# Altium schematic sheet connector-bottom-j1-1.SchDoc: Connector - J1(Bottom) 1
size Letter; CompanyName: Brinton Engineering, LLC; Address1: 3479 Edison Way; Address2: Menlo Park CA 94025; Address3: +1 (877) 778-8435; Address4: brintonengineering.com; Revision: 1; SheetNumber: 1; SheetTotal: 1
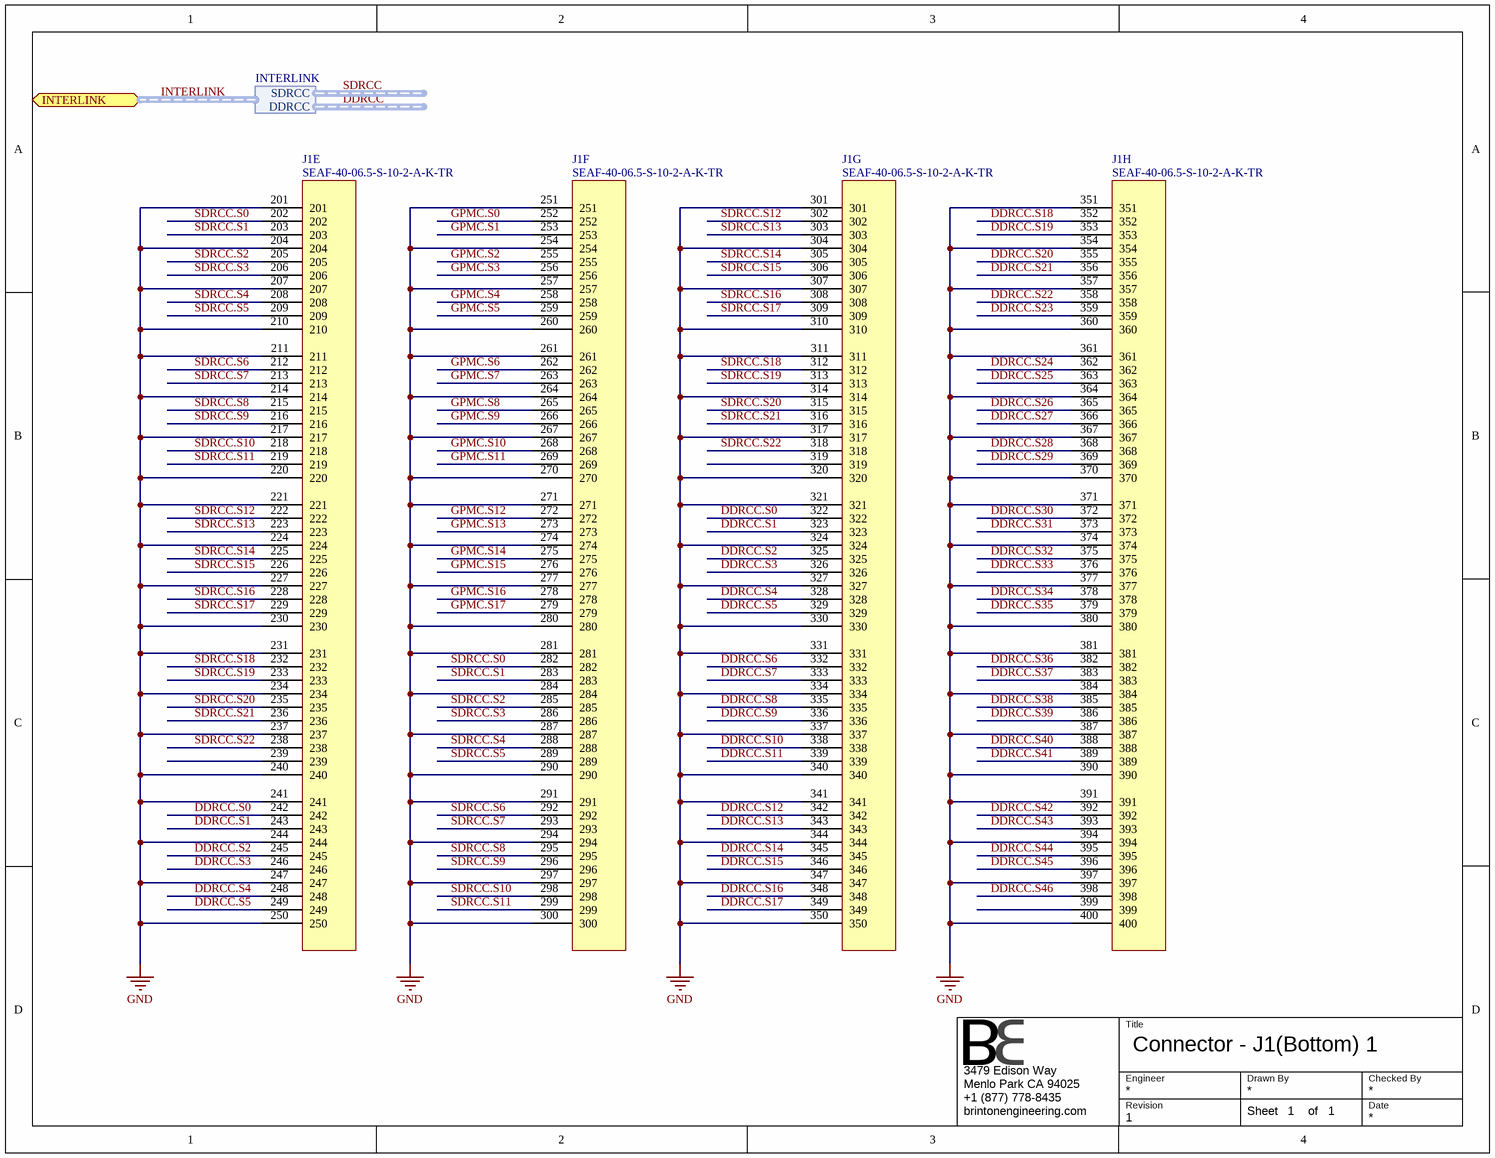
[diagram p0: connector-bottom-j1-1.SchDoc]

## Parts
J1  SEAF-40-06.5-S-10-2-A-K-TR  [SEAF-40-06.5-S-10-2-A-K-TR]  (parts E,F,G,H of 8)

## Ports
INTERLINK (harness INTERLINK)

## Harnesses
INTERLINK: DDRCC, SDRCC

## Nets
GND: J1.201 J1.204 J1.207 J1.210 J1.211 J1.214 J1.217 J1.220 J1.221 J1.224 J1.227 J1.230 J1.231 J1.234 J1.237 J1.240 J1.241 J1.244 J1.247 J1.250 J1.251 J1.254 J1.257 J1.260 J1.261 J1.264 J1.267 J1.270 J1.271 J1.274 J1.277 J1.280 J1.281 J1.284 J1.287 J1.290 J1.291 J1.294 J1.297 J1.300 J1.301 J1.304 J1.307 J1.310 J1.311 J1.314 J1.317 J1.320 J1.321 J1.324 J1.327 J1.330 J1.331 J1.334 J1.337 J1.340 J1.341 J1.344 J1.347 J1.350 J1.351 J1.354 J1.357 J1.360 J1.361 J1.364 J1.367 J1.370 J1.371 J1.374 J1.377 J1.380 J1.381 J1.384 J1.387 J1.390 J1.391 J1.394 J1.397 J1.400
DDRCC.S0: J1.242 J1.322
DDRCC.S1: J1.243 J1.323
DDRCC.S2: J1.245 J1.325
DDRCC.S3: J1.246 J1.326
DDRCC.S4: J1.248 J1.328
DDRCC.S5: J1.249 J1.329
DDRCC.S6: J1.332
DDRCC.S7: J1.333
DDRCC.S8: J1.335
DDRCC.S9: J1.336
DDRCC.S10: J1.338
DDRCC.S11: J1.339
DDRCC.S12: J1.342
DDRCC.S13: J1.343
DDRCC.S14: J1.345
DDRCC.S15: J1.346
DDRCC.S16: J1.348
DDRCC.S17: J1.349
DDRCC.S18: J1.352
DDRCC.S19: J1.353
DDRCC.S20: J1.355
DDRCC.S21: J1.356
DDRCC.S22: J1.358
DDRCC.S23: J1.359
DDRCC.S24: J1.362
DDRCC.S25: J1.363
DDRCC.S26: J1.365
DDRCC.S27: J1.366
DDRCC.S28: J1.368
DDRCC.S29: J1.369
DDRCC.S30: J1.372
DDRCC.S31: J1.373
DDRCC.S32: J1.375
DDRCC.S33: J1.376
DDRCC.S34: J1.378
DDRCC.S35: J1.379
DDRCC.S36: J1.382
DDRCC.S37: J1.383
DDRCC.S38: J1.385
DDRCC.S39: J1.386
DDRCC.S40: J1.388
DDRCC.S41: J1.389
DDRCC.S42: J1.392
DDRCC.S43: J1.393
DDRCC.S44: J1.395
DDRCC.S45: J1.396
DDRCC.S46: J1.398
GPMC.S0: J1.252
GPMC.S1: J1.253
GPMC.S2: J1.255
GPMC.S3: J1.256
GPMC.S4: J1.258
GPMC.S5: J1.259
GPMC.S6: J1.262
GPMC.S7: J1.263
GPMC.S8: J1.265
GPMC.S9: J1.266
GPMC.S10: J1.268
GPMC.S11: J1.269
GPMC.S12: J1.272
GPMC.S13: J1.273
GPMC.S14: J1.275
GPMC.S15: J1.276
GPMC.S16: J1.278
GPMC.S17: J1.279
SDRCC.S0: J1.202 J1.282
SDRCC.S1: J1.203 J1.283
SDRCC.S2: J1.205 J1.285
SDRCC.S3: J1.206 J1.286
SDRCC.S4: J1.208 J1.288
SDRCC.S5: J1.209 J1.289
SDRCC.S6: J1.212 J1.292
SDRCC.S7: J1.213 J1.293
SDRCC.S8: J1.215 J1.295
SDRCC.S9: J1.216 J1.296
SDRCC.S10: J1.218 J1.298
SDRCC.S11: J1.219 J1.299
SDRCC.S12: J1.222 J1.302
SDRCC.S13: J1.223 J1.303
SDRCC.S14: J1.225 J1.305
SDRCC.S15: J1.226 J1.306
SDRCC.S16: J1.228 J1.308
SDRCC.S17: J1.229 J1.309
SDRCC.S18: J1.232 J1.312
SDRCC.S19: J1.233 J1.313
SDRCC.S20: J1.235 J1.315
SDRCC.S21: J1.236 J1.316
SDRCC.S22: J1.238 J1.318

Not connected (* = marked no-connect by the designer): J1 239 319 399

## Buses and harness runs
harness INTERLINK = port INTERLINK

## Notes on the sheet
- Title
- Engineer
- Revision
- Drawn By
- Checked By
- Date
- Sheet
- of

## Library data of the parts
J1 = SEAF-40-06.5-S-10-2-A-K-TR: Terminal Array Assembly, Surface Mount, 0.050" Pitch, 400 Pins; Manufacturer: Samtec; Manufacturer P/N: SEAF-40-06.5-S-10-2-A-K-TR